# Altium project PCB_Project2.PrjPCB
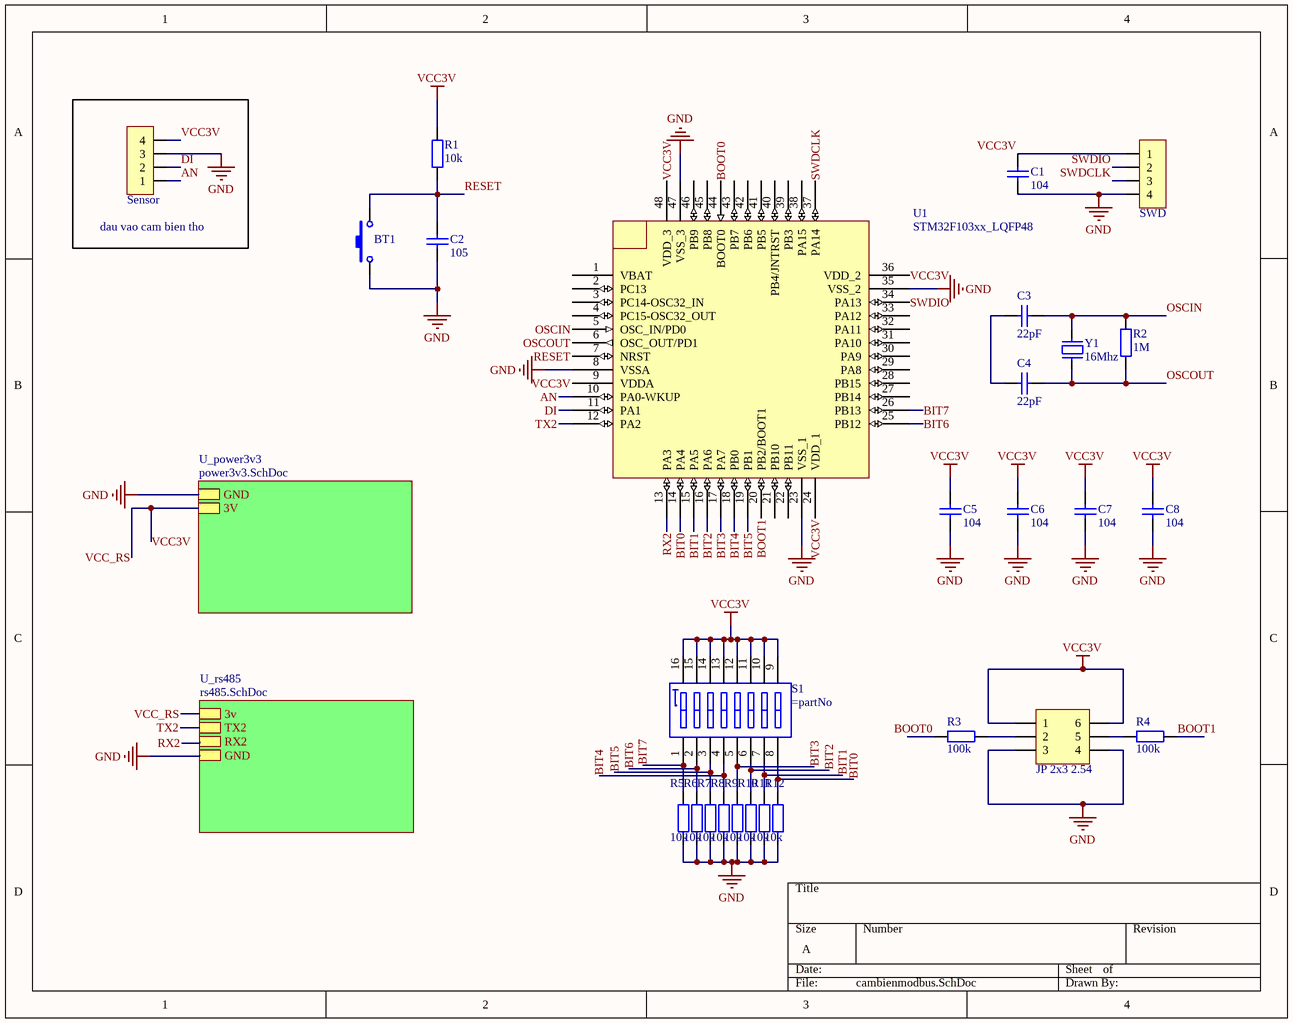
[diagram p0: cambienmodbus.SchDoc]
3 sheets, 54 parts. Net scope: hierarchical (ports join the sheet entries above them; power ports are global).
Board file: PCB_CAMBIEN_VER2.PcbDoc
Sheets:
  cambienmodbus.SchDoc
    U_rs485 = rs485.SchDoc
    U_power3v3 = power3v3.SchDoc

## Sheet cambienmodbus.SchDoc
size A

### Parts
BT1  Nut Nhan 2 Chan SMD 3x6x2.5  [Nut Nhan 2 Chan SMD 3x6x2.5]  (value not drawn)
C1  104  [tu 0603]
C2  105  [tu 0603]
C3  22pF  [tu 0603]
C4  22pF  [tu 0603]
C5  104  [tu 0603]
C6  104  [tu 0603]
C7  104  [tu 0603]
C8  104  [tu 0603]
JP1  Sensor  [JP 1x4 CC]
JP2  SWD  [JP 1x4 DT]
JP3  JP 2x3 2.54  [JP 2x3 DT]
R1  10k  [tro smd 0603]
R2  1M  [tro smd 0603]
R3  100k  [tro smd 0603]
R4  100k  [tro smd 0603]
R5  10k  [tro smd 0603]
R6  10k  [tro smd 0603]
R7  10k  [tro smd 0603]
R8  10k  [tro smd 0603]
R9  10k  [tro smd 0603]
R10  10k  [tro smd 0603]
R11  10k  [tro smd 0603]
R12  10k  [tro smd 0603]
S1  (no value)  [SW-DIP8]
U1  STM32F103xx_LQFP48  [STM32_LQPF48]
Y1  16Mhz  [Thach Anh 2 chan cam]

### Blocks framed on the sheet
dau vao cam bien tho: JP1

### Sub-sheets
U_power3v3 = power3v3.SchDoc: GND, 3V
U_rs485 = rs485.SchDoc: 3v, TX2, RX2, GND

### Nets
GND: BT1.1 C1.2 C2.2 C5.2 C6.2 C7.2 C8.2 JP1.3 JP2.4 JP3.3 JP3.4 R5.1 R6.1 R7.1 R8.1 R9.1 R10.1 R11.1 R12.1 U1.8(VSSA) U1.23(VSS_1) U1.35(VSS_2) U1.47(VSS_3) ; sheet U_rs485/GND, sheet U_power3v3/GND
VCC3V: C1.1 C5.1 C6.1 C7.1 C8.1 JP1.4 JP2.1 JP3.1 JP3.6 R1.2 S1.9 S1.10 S1.11 S1.12 S1.13 S1.14 S1.15 S1.16 U1.9(VDDA) U1.24(VDD_1) U1.36(VDD_2) U1.48(VDD_3) ; sheet U_rs485/3v, sheet U_power3v3/3V  [also labelled VCC_RS]
AN: JP1.1 U1.10(PA0-WKUP)
BIT0: R12.2 S1.8 U1.14(PA4)
BIT1: R11.2 S1.7 U1.15(PA5)
BIT2: R10.2 S1.6 U1.16(PA6)
BIT3: R9.2 S1.5 U1.17(PA7)
BIT4: R8.2 S1.4 U1.18(PB0)
BIT5: R7.2 S1.3 U1.19(PB1)
BIT6: R6.2 S1.2 U1.25(PB12)
BIT7: R5.2 S1.1 U1.26(PB13)
BOOT0: R3.1 U1.44(BOOT0)
BOOT1: R4.2 U1.20(PB2/BOOT1)
DI: JP1.2 U1.11(PA1)
OSCIN: C3.1 R2.2 U1.5(OSC_IN/PD0) Y1.2
OSCOUT: C4.1 R2.1 U1.6(OSC_OUT/PD1) Y1.1
RESET: BT1.2 C2.1 R1.1 U1.7(NRST)
RX2: U1.13(PA3) ; sheet U_rs485/RX2
SWDCLK: JP2.3 U1.37(PA14)
SWDIO: JP2.2 U1.34(PA13)
TX2: U1.12(PA2) ; sheet U_rs485/TX2
NetC3_2: C3.2 C4.2
NetJP3_2: JP3.2 R3.2
NetJP3_5: JP3.5 R4.1

Not connected (* = marked no-connect by the designer): U1 1(VBAT) 2(PC13) 3(PC14-OSC32_IN) 4(PC15-OSC32_OUT) 21(PB10) 22(PB11) 27(PB14) 28(PB15) 29(PA8) 30(PA9) 31(PA10) 32(PA11) 33(PA12) 38(PA15) 39(PB3) 40(PB4/JNTRST) 41(PB5) 42(PB6) 43(PB7) 45(PB8) 46(PB9)

### Library data of the parts
BT1 = Nut Nhan 2 Chan SMD 3x6x2.5: Ma_Hang: MH001036; Ten: Nút Nhấn 2 Chân 3x6x2.5MM SMD
C1 C5-C8 = Tu 0603 104 50V 10%: Dán; Don_Vi: Con; So_Chan: 2; Ten_Linh_Kien: Tụ 0603 104-100nF 10% 50V; Ma_Hang: MH004568; Chung_Loai: Dán; Kieu_Chan: *
C2 = Tu 0603 105 16V 20%: Dán; Don_Vi: Con; So_Chan: 2; Ten_Linh_Kien: Tụ 0603 105-1uF 20% 16V; Ma_Hang: MH004574; Chung_Loai: Dán; Kieu_Chan: *
C3 C4 = Tu 0603 22pF 50V 10%: Dán; Don_Vi: Con; So_Chan: 2; Ten_Linh_Kien: Tụ 0603 22pF 50V 10%; Ma_Hang: MH004570; Chung_Loai: Dán; Kieu_Chan: *
JP1 = JP 1x4 2.54 Cai Cong: Cắm; Ten_Linh_Kien: Jump Đơn Cái 2.54MM 1x40P Cong; Don_Vi: Con; Ma_Hang: MH001265; Ghi_Chu: *; Kieu_Chan: *; Chung_Loai: Cắm
JP2 = JP 1x4 2.54 Duc Thang: Cắm; Ten_Linh_Kien: Jump Đơn Đực 2.54MM 1x40P Thẳng 11MM; Don_Vi: Con; Ma_Hang: MH000903; Ghi_Chu: *; Kieu_Chan: *; Chung_Loai: Cắm
JP3 = JP 2x3 2.54 Duc Thang: Cắm; Ten_Linh_Kien: Jump Đôi Đực 2.54MM 2x40P Thẳng 11MM; Don_Vi: Con; Ma_Hang: MH002686; Ghi_Chu: *; Kieu_Chan: *; Chung_Loai: Cắm
R1 R5-R12 = Tro 0603 5% 10k: Dán; Don_Vi: Con; So_Chan: 2; Ten_Linh_Kien: Trở 0603 5% 10k; Ma_Hang: MH006316; Chung_Loai: Dán; Kieu_Chan: *
R2 = Tro 0603 5% 1M: Dán; Don_Vi: Con; So_Chan: 2; Ten_Linh_Kien: Trở 0603 5% 1M; Ma_Hang: MH006909; Chung_Loai: Dán; Kieu_Chan: *
R3 R4 = Tro 0603 5% 100k: Dán; So_Chan: 2; Ten_Linh_Kien: Trở 0603 5% 100k; Ma_Hang: MH006314; Don_Vi: Con; Chung_Loai: Dán; Kieu_Chan: *
S1 = SWDIP8: WS-DITV 2.54 mm small compact THT flat actuator with top tape; Manufacturer: Wurth Elektronik; Part No.: 418127160908; ComponentLink1 Description: Manufacturer; ComponentLink2 Description: Datasheet; Pole: 08; Created Date: Dec.2015; ComponentLink1URL: http://www.we-online.com; ComponentLink2URL: http://katalog.we-online.de/em/datasheet/4181271609xx.pdf; Created by: Baojun Chen
Y1 = Thach Anh 2 chan Cam: Crystal For all Crystal 2pin.; Value: 4Mhz
U1 = STM32F103xx_LQFP48: Published: 30-May-2008; DatasheetVersion: rev6, Mar-2008; PackageVersion: Mar-2008; PackageReference: LQFP48; Publisher: Altium Limited; PackageDescription: 48-Pin Low-Profile Quad Flat Pack, 7 x 7 mm Body, 0.5 mm Pitch (LQFP48); ComponentLink1Description: Manufacturer Link; ComponentLink1URL: www.st.com/stm32; ComponentLink2Description: Datasheet; ComponentLink2URL: http://www.st.com/stonline/products/literature/ds/13587.pdf

## Sheet rs485.SchDoc
size A
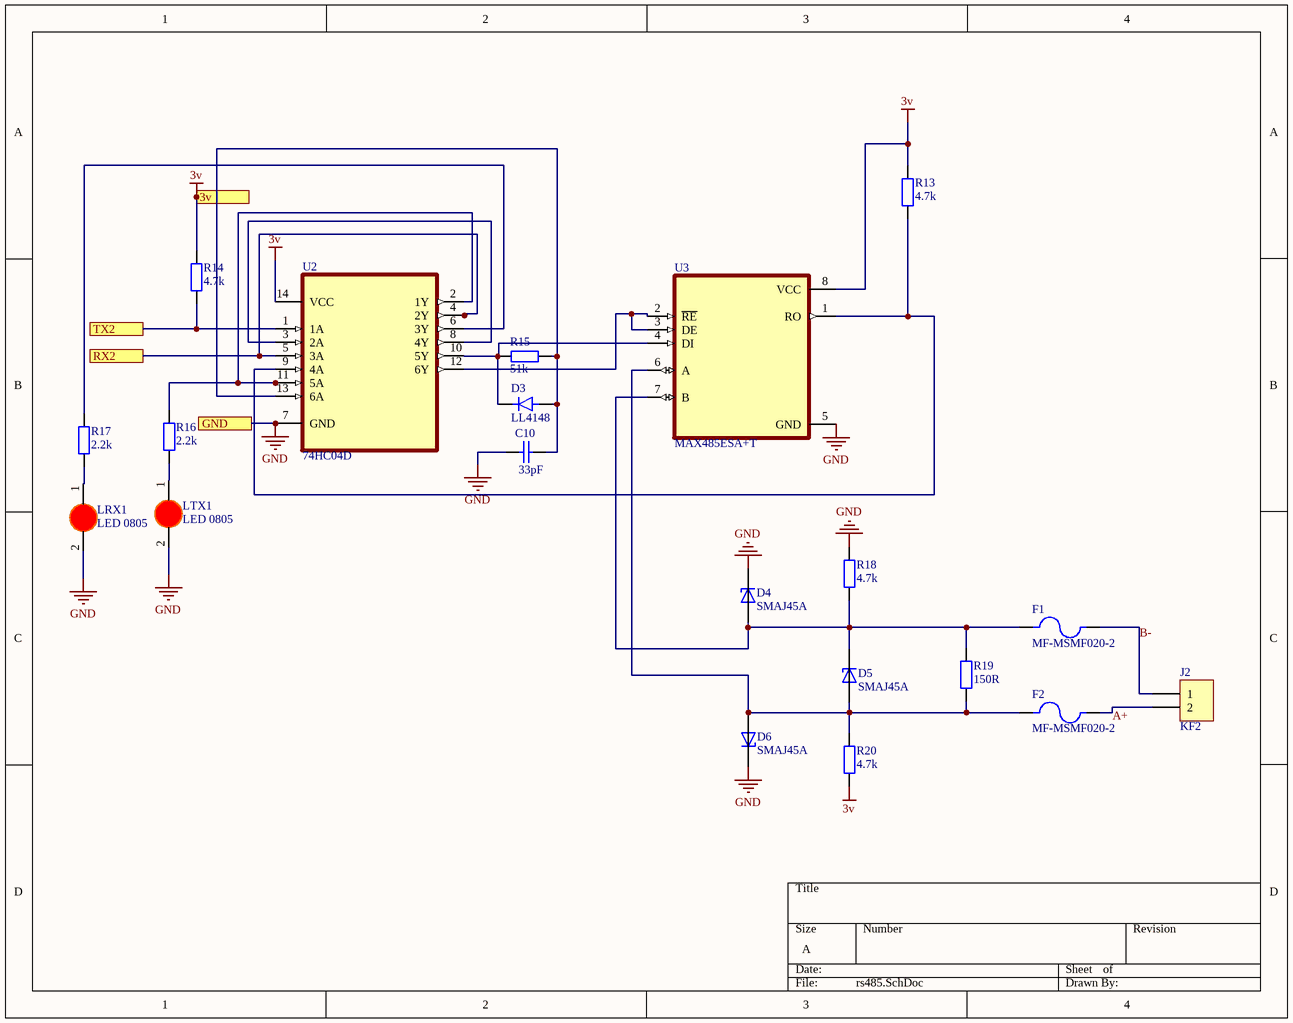
[diagram p1: rs485.SchDoc]

### Parts
C10  33pF  [tu 0805]
D3  LL4148  [DIO_LL4148]
D4  SMAJ45A  [DIOM4325X250N]
D5  SMAJ45A  [DIOM4325X250N]
D6  SMAJ45A  [DIOM4325X250N]
F1  MF-MSMF020-2  [FUSER_MF-MSMF020-2]
F2  MF-MSMF020-2  [FUSER_MF-MSMF020-2]
J2  KF2  [KF2-3.5]
LRX1  LED 0805  [LED-0805-Red]
LTX1  LED 0805  [LED-0805-Red]
R13  4.7k  [tro smd 0603]
R14  4.7k  [tro smd 0603]
R15  51k  [tro smd 0603]
R16  2.2k  [tro smd 0603]
R17  2.2k  [tro smd 0603]
R18  4.7k  [tro smd 0603]
R19  150R  [tro smd 0603]
R20  4.7k  [tro smd 0603]
U2  74HC04D  [SOIC127P600X175-14N]
U3  MAX485ESA+T  [SOIC127P600X175-8N]

### Ports
3v, GND, RX2, TX2

### Nets
3v: R13.2 R14.2 R20.1 U2.14(VCC) U3.8(VCC) ; port 3v  [project net VCC3V]
GND: C10.2 D4.C D6.C LRX1.2(K) LTX1.2(K) R18.2 U2.7(GND) U3.5(GND) ; port GND
A+: F2.2 J2.2
B-: F1.2 J2.1
RX2: U2.4(2Y) U2.5(3A) ; port RX2
TX2: R14.1 U2.1(1A) ; port TX2
NetC10_1: C10.1 D3.A R15.2 U2.13(6A)
NetD3_C: D3.C R15.1 U2.10(5Y) U3.4(DI)
NetD4_A: D4.A D5.C F1.1 R18.1 R19.2 U3.7(B)
NetD5_A: D5.A D6.A F2.1 R19.1 R20.2 U3.6(A)
NetLRX1_1: LRX1.1(A) R17.1
NetLTX1_1: LTX1.1(A) R16.1
NetR13_1: R13.1 U2.9(4A) U3.1(RO)
NetR16_2: R16.2 U2.2(1Y) U2.11(5A)
NetR17_2: R17.2 U2.6(3Y)
NetU2_3: U2.3(2A) U2.8(4Y)
NetU2_12: U2.12(6Y) U3.2(~{RE}) U3.3(DE)

### Library data of the parts
C10 = Tu 0805 33pF 50V 10%: Dán; Don_Vi: Con; So_Chan: 2; Ten_Linh_Kien: Tụ 0805 33p 10% 50V; Ma_Hang: MH004563; Chung_Loai: Dán; Kieu_Chan: *
D3 = LL4148: Diode Small Signal Switching 100V 0.15A Automotive 2-Pin Mini-MELF T/R; MF: Diotec Semiconductor; Value: *; SnapEDA_Link: https://www.snapeda.com/parts/LL4148/Diotec/view-part/?ref=snap; Purchase-URL: https://pricing.snapeda.com/search/part/LL4148/?ref=eda; Availability: In Stock; Price: None; Package: MINIMELF-2 Diotec; Check_prices: https://www.snapeda.com/parts/LL4148/Diotec/view-part/?ref=eda; MP: LL4148
D4-D6 = SMAJ45A: 72.7V Clamp 5.5A Ipp Tvs Diode Surface Mount DO-214AC (SMA); MF: Littelfuse; Value: *; Check_prices: https://www.snapeda.com/parts/SMAJ45A/Littelfuse/view-part/?ref=eda; Package: DO-214; Availability: Unavailable; SnapEDA_Link: https://www.snapeda.com/parts/SMAJ45A/Littelfuse/view-part/?ref=snap; MP: SMAJ45A; Price: None
F1 F2 = MF-MSMF020-2: Polymeric PTC Resettable Fuse 30V 200 mA Ih Surface Mount 1812 (4532 Metric), Concave; MF: Bourns; Package: 1812 Bourns; Price: None; MP: MF-MSMF020-2; Availability: In Stock; Value: *; Check_prices: https://www.snapeda.com/parts/MF-MSMF020-2/Bourns/view-part/?ref=eda; Purchase-URL: https://pricing.snapeda.com/search/part/MF-MSMF020-2/?ref=eda; SnapEDA_Link: https://www.snapeda.com/parts/MF-MSMF020-2/Bourns/view-part/?ref=snap
J2 = KF2: Manufacturer: Würth Elektronik eiSos GmbH; partNo: 691103110002; ComponentLink1 Description: Manufacturer; ComponentLink2 Description: Datasheet; NoPins: 2; Created Date: 29 October 2013; ComponentLink1URL: http://www.we-online.com; ComponentLink2URL: http://katalog.we-online.de/em/datasheet/6911031100xx.pdf; Created by: Karrer Zheng
LRX1 LTX1 = LED 0805 Do: Dán; Don_Vi: Con; Ma_Hang: MH000897; Ten_Linh_Kien: LED 0805 Màu Đỏ (Red); Ghi_Chu: *; Kieu_Chan: *; Chung_Loai: Dán
R13 R14 R18 R20 = Tro 0603 5% 4.7k: Dán; Don_Vi: Con; So_Chan: 2; Ten_Linh_Kien: Trở 0603 5% 4.7k; Ma_Hang: MH006327; Chung_Loai: Dán; Kieu_Chan: *
R15 = Tro 0603 5% 51k: Dán; Don_Vi: Con; So_Chan: 2; Ten_Linh_Kien: Trở 0603 5% 51k; Ma_Hang: MH007666; Chung_Loai: Dán; Kieu_Chan: *
R16 R17 = Tro 0603 5% 2.2k: Dán; Don_Vi: Con; So_Chan: 2; Ten_Linh_Kien: Trở 0603 5% 2.2k; Ma_Hang: MH006321; Chung_Loai: Dán; Kieu_Chan: *
R19 = Tro 0603 5% 150R: Dán; Don_Vi: Con; So_Chan: 2; Ten_Linh_Kien: Trở 0603 5% 150R; Ma_Hang: MH006318; Chung_Loai: Dán; Kieu_Chan: *
U2 = 74HC04D: Inverter IC 6 Channel 14-SOIC; MF: Toshiba; Value: *; MP: 74HC04D; Package: SOIC-14 NXP Semiconductors; Price: None; Availability: Unavailable; SnapEDA_Link: https://www.snapeda.com/parts/74HC04D/Toshiba%20Semiconductor%20and%20Storage/view-part/1040011/?ref=snap
U3 = MAX485ESA+T: 1/1 Transceiver Half RS422, RS485 8-SOIC; MF: Maxim Integrated; MP: MAX485ESA; SnapEDA_Link: https://www.snapeda.com/parts/MAX485ESA/Maxim+Integrated/view-part/?ref=snap; Purchase-URL: https://pricing.snapeda.com/search/part/MAX485ESA/?ref=eda; Value: *; Package: SOIC-8 Maxim; Price: None; Availability: In Stock; Check_prices: https://www.snapeda.com/parts/MAX485ESA/Maxim+Integrated/view-part/?ref=eda

## Sheet power3v3.SchDoc
size A
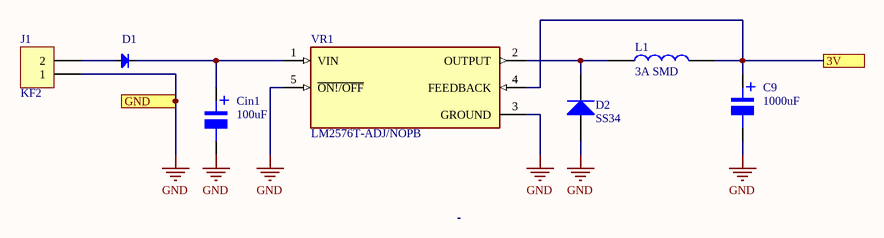
[diagram p2: power3v3.SchDoc]

### Parts
C9  1000uF  [tu nhom 10 (G)]
Cin1  100uF  [tu nhom 6.3 (d)]
D1  Diode  [DIO-3A]  (value not drawn)
D2  SS34  [DIODE SMA]
J1  KF2  [KF2-3.5]
L1  3A SMD  [Cuon Cam 12x12x10]
VR1  LM2576T-ADJ/NOPB  [TO170P1067X483X1651-5]

### Ports
3V, GND

### Nets
GND: C9.2 Cin1.2 D2.1(A) J1.1 VR1.3(GROUND) VR1.5(~{ON!/OFF}) ; port GND
VCC3V: C9.1 L1.2 VR1.4(FEEDBACK) ; port 3V
NetCin1_1: Cin1.1 D1.2(K) VR1.1(VIN)
NetD1_1: D1.1(A) J1.2
NetD2_2: D2.2(K) L1.1 VR1.2(OUTPUT)

### Notes on the sheet
- (in symbol Tu Nhom 100uF 16V) +
- (in symbol Tu Nhom 1000uF 10V) +

### Library data of the parts
C9 = Tu Nhom 1000uF 10V: Dán; So_Chan: 2; Don_Vi: Con; Ten_Linh_Kien: Tụ Nhôm 1000uF 10V; Ma_Hang: MH007515; Chung_Loai: Dán; Kieu_Chan: *
Cin1 = Tu Nhom 100uF 16V: Dán; Don_Vi: Con; So_Chan: 2; Ten_Linh_Kien: Tụ Nhôm 100uF 16V 6.3x5.4MM; Ma_Hang: MH002219; Chung_Loai: Dán; Kieu_Chan: *
D1 = Diode: Default Diode; Code - JEDEC: DO-214-AB; Value: 1N5007; Published: 8-Jun-2000; Revision: July-2002: Re-released for DXP Platform.; Publisher: Altium Limited
D2 = Diode SS34 ( 1N5822 ): Dán; Don_Vi: Con; Ma_Hang: MH002104; Ten_Linh_Kien: Diode SS34 3A 40V SMA ( 1N5822 SS34A); Kieu_Chan: *; Chung_Loai: Dán
J1 = KF2: as J2 on sheet rs485; Created Date: 29 October 2013; ComponentLink1URL: http://www.we-online.com; ComponentLink2URL: http://katalog.we-online.de/em/datasheet/6911031100xx.pdf; Created by: Karrer Zheng
L1 = CUON CAM 100uH SMD: Dán; Don_Vi: Con; Ma_Hang: MH003999; Ten_Linh_Kien: Cuộn Cảm 100uH 7x7x4MM CD74; Ma_Hang: *; Kieu_Chan: *; Chung_Loai: Dán
VR1 = LM2576T-ADJ/NOPB: SIMPLE SWITCHERÂ® 40V, 3A Low Component Count Step-Down Regulator; Package: None; Value: *; MP: LM2576T-ADJ/NOPB; Availability: Unavailable; Price: None

## Nets that join several sheets
GND: cambienmodbus (23 pins), rs485 (8 pins), power3v3 (6 pins)
VCC3V: cambienmodbus (22 pins), rs485 (5 pins), power3v3 (C9.1 L1.2 VR1.4)
RX2: cambienmodbus (U1.13), rs485 (U2.4 U2.5)
TX2: cambienmodbus (U1.12), rs485 (R14.1 U2.1)